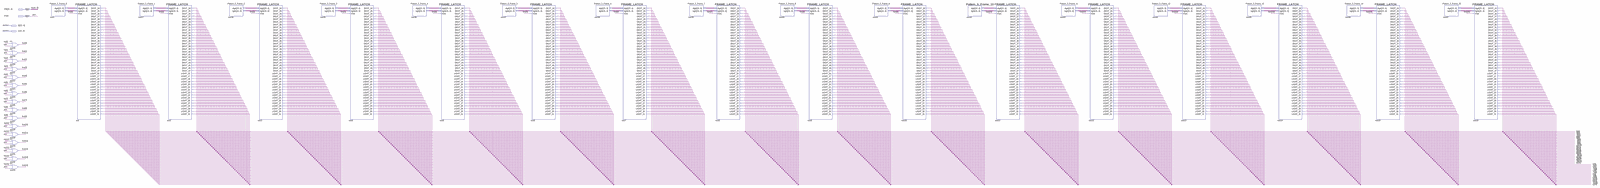
[diagram p0: schematic sheet, whole]
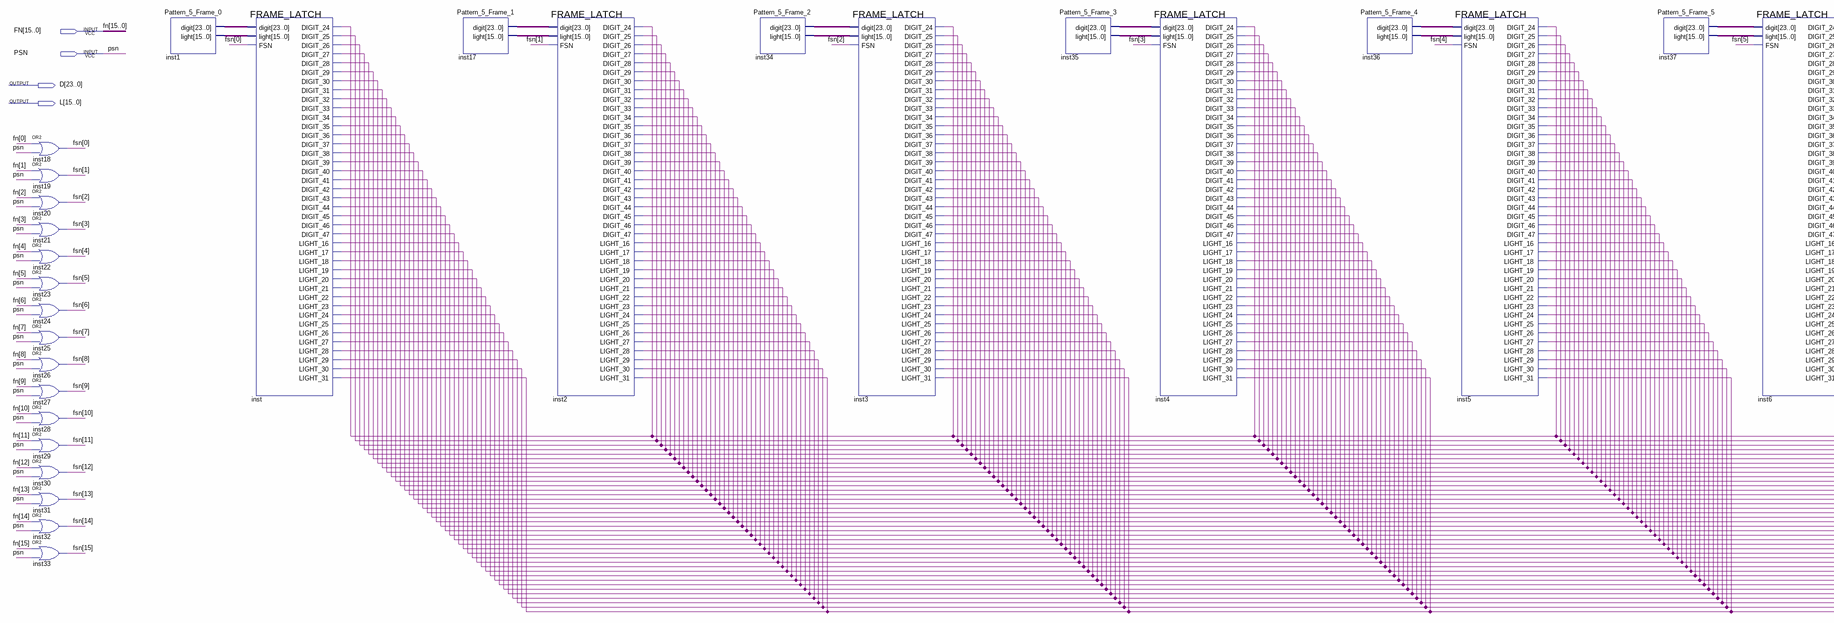
[diagram p1: schematic sheet, left part]
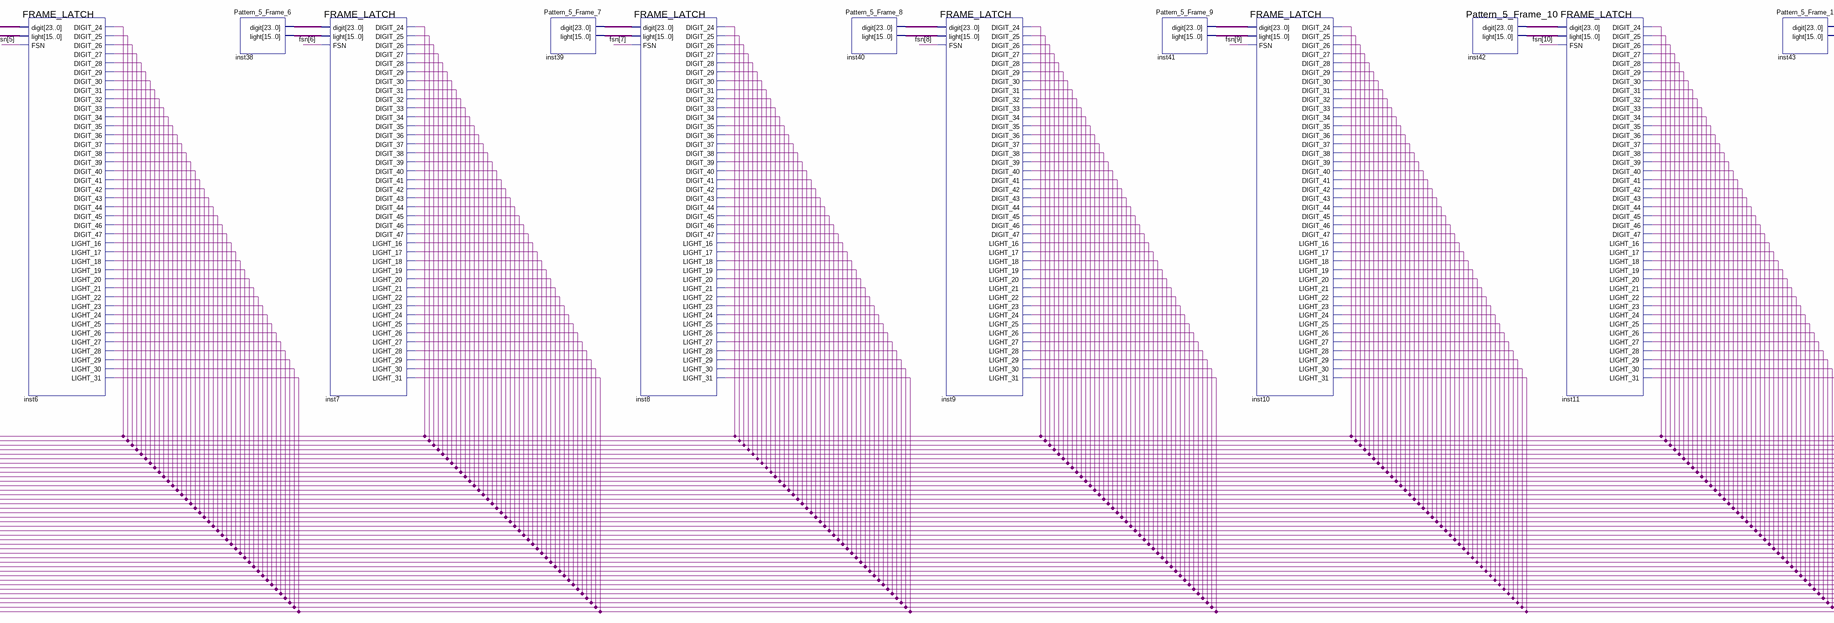
[diagram p2: schematic sheet, centre part]
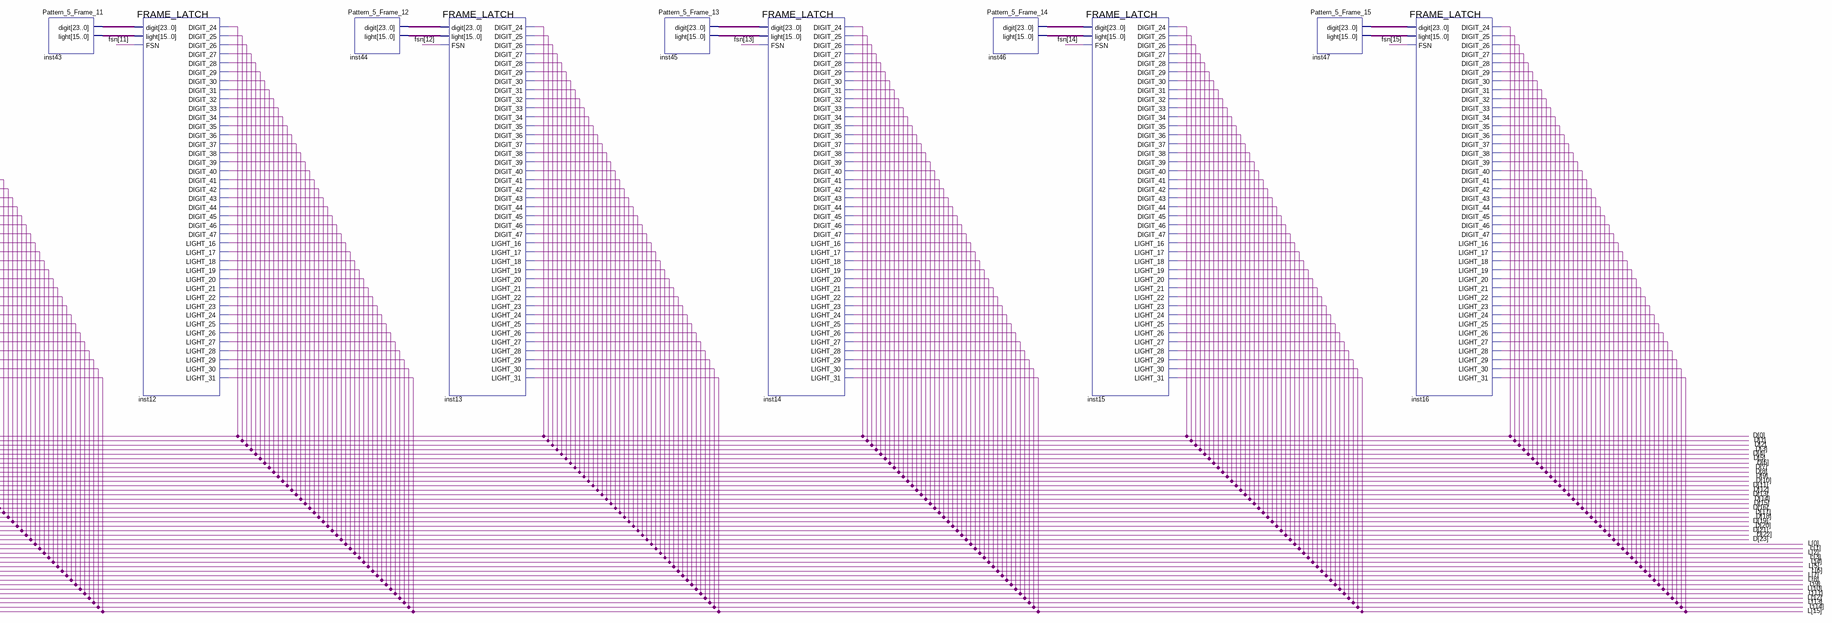
[diagram p3: schematic sheet, right part]
// Quartus schematic Pattern_5.bdf as structural Verilog: 48 symbols, 4 pins
module Pattern_5 (
  input  [15:0] FN,
  input  PSN,
  output [23:0] D,
  output [15:0] L
);

  wire [15:0] fsn, inst1_light, inst17_light, inst34_light, inst35_light, inst36_light, inst37_light,
       inst38_light, inst39_light, inst40_light, inst41_light, inst42_light, inst43_light, inst44_light,
       inst45_light, inst46_light, inst47_light;
  wire [23:0] inst1_digit, inst17_digit, inst34_digit, inst35_digit, inst36_digit, inst37_digit,
       inst38_digit, inst39_digit, inst40_digit, inst41_digit, inst42_digit, inst43_digit, inst44_digit,
       inst45_digit, inst46_digit, inst47_digit;

  or inst18 (fsn[0], FN[0], PSN);
  or inst19 (fsn[1], FN[1], PSN);
  or inst20 (fsn[2], FN[2], PSN);
  or inst21 (fsn[3], FN[3], PSN);
  or inst22 (fsn[4], FN[4], PSN);
  or inst23 (fsn[5], FN[5], PSN);
  or inst24 (fsn[6], FN[6], PSN);
  or inst25 (fsn[7], FN[7], PSN);
  or inst26 (fsn[8], FN[8], PSN);
  or inst27 (fsn[9], FN[9], PSN);
  or inst28 (fsn[10], FN[10], PSN);
  or inst29 (fsn[11], FN[11], PSN);
  or inst30 (fsn[12], FN[12], PSN);
  or inst31 (fsn[13], FN[13], PSN);
  or inst32 (fsn[14], FN[14], PSN);
  or inst33 (fsn[15], FN[15], PSN);
  Pattern_5_Frame_0 inst1 (.digit(inst1_digit), .light(inst1_light));
  FRAME_LATCH inst (
    .digit(inst1_digit), .light(inst1_light), .FSN(fsn[0]), .DIGIT_24(D[0]), .DIGIT_25(D[1]),
    .DIGIT_26(D[2]), .DIGIT_27(D[3]), .DIGIT_28(D[4]), .DIGIT_29(D[5]), .DIGIT_30(D[6]), .DIGIT_31(D[7]),
    .DIGIT_32(D[8]), .DIGIT_33(D[9]), .DIGIT_34(D[10]), .DIGIT_35(D[11]), .DIGIT_36(D[12]), .DIGIT_37(D[13]),
    .DIGIT_38(D[14]), .DIGIT_39(D[15]), .DIGIT_40(D[16]), .DIGIT_41(D[17]), .DIGIT_42(D[18]),
    .DIGIT_43(D[19]), .DIGIT_44(D[20]), .DIGIT_45(D[21]), .DIGIT_46(D[22]), .DIGIT_47(D[23]),
    .LIGHT_16(L[0]), .LIGHT_17(L[1]), .LIGHT_18(L[2]), .LIGHT_19(L[3]), .LIGHT_20(L[4]), .LIGHT_21(L[5]),
    .LIGHT_22(L[6]), .LIGHT_23(L[7]), .LIGHT_24(L[8]), .LIGHT_25(L[9]), .LIGHT_26(L[10]), .LIGHT_27(L[11]),
    .LIGHT_28(L[12]), .LIGHT_29(L[13]), .LIGHT_30(L[14]), .LIGHT_31(L[15]));
  Pattern_5_Frame_1 inst17 (.digit(inst17_digit), .light(inst17_light));
  FRAME_LATCH inst2 (
    .digit(inst17_digit), .light(inst17_light), .FSN(fsn[1]), .DIGIT_24(D[0]), .DIGIT_25(D[1]),
    .DIGIT_26(D[2]), .DIGIT_27(D[3]), .DIGIT_28(D[4]), .DIGIT_29(D[5]), .DIGIT_30(D[6]), .DIGIT_31(D[7]),
    .DIGIT_32(D[8]), .DIGIT_33(D[9]), .DIGIT_34(D[10]), .DIGIT_35(D[11]), .DIGIT_36(D[12]), .DIGIT_37(D[13]),
    .DIGIT_38(D[14]), .DIGIT_39(D[15]), .DIGIT_40(D[16]), .DIGIT_41(D[17]), .DIGIT_42(D[18]),
    .DIGIT_43(D[19]), .DIGIT_44(D[20]), .DIGIT_45(D[21]), .DIGIT_46(D[22]), .DIGIT_47(D[23]),
    .LIGHT_16(L[0]), .LIGHT_17(L[1]), .LIGHT_18(L[2]), .LIGHT_19(L[3]), .LIGHT_20(L[4]), .LIGHT_21(L[5]),
    .LIGHT_22(L[6]), .LIGHT_23(L[7]), .LIGHT_24(L[8]), .LIGHT_25(L[9]), .LIGHT_26(L[10]), .LIGHT_27(L[11]),
    .LIGHT_28(L[12]), .LIGHT_29(L[13]), .LIGHT_30(L[14]), .LIGHT_31(L[15]));
  Pattern_5_Frame_2 inst34 (.digit(inst34_digit), .light(inst34_light));
  FRAME_LATCH inst3 (
    .digit(inst34_digit), .light(inst34_light), .FSN(fsn[2]), .DIGIT_24(D[0]), .DIGIT_25(D[1]),
    .DIGIT_26(D[2]), .DIGIT_27(D[3]), .DIGIT_28(D[4]), .DIGIT_29(D[5]), .DIGIT_30(D[6]), .DIGIT_31(D[7]),
    .DIGIT_32(D[8]), .DIGIT_33(D[9]), .DIGIT_34(D[10]), .DIGIT_35(D[11]), .DIGIT_36(D[12]), .DIGIT_37(D[13]),
    .DIGIT_38(D[14]), .DIGIT_39(D[15]), .DIGIT_40(D[16]), .DIGIT_41(D[17]), .DIGIT_42(D[18]),
    .DIGIT_43(D[19]), .DIGIT_44(D[20]), .DIGIT_45(D[21]), .DIGIT_46(D[22]), .DIGIT_47(D[23]),
    .LIGHT_16(L[0]), .LIGHT_17(L[1]), .LIGHT_18(L[2]), .LIGHT_19(L[3]), .LIGHT_20(L[4]), .LIGHT_21(L[5]),
    .LIGHT_22(L[6]), .LIGHT_23(L[7]), .LIGHT_24(L[8]), .LIGHT_25(L[9]), .LIGHT_26(L[10]), .LIGHT_27(L[11]),
    .LIGHT_28(L[12]), .LIGHT_29(L[13]), .LIGHT_30(L[14]), .LIGHT_31(L[15]));
  Pattern_5_Frame_3 inst35 (.digit(inst35_digit), .light(inst35_light));
  FRAME_LATCH inst4 (
    .digit(inst35_digit), .light(inst35_light), .FSN(fsn[3]), .DIGIT_24(D[0]), .DIGIT_25(D[1]),
    .DIGIT_26(D[2]), .DIGIT_27(D[3]), .DIGIT_28(D[4]), .DIGIT_29(D[5]), .DIGIT_30(D[6]), .DIGIT_31(D[7]),
    .DIGIT_32(D[8]), .DIGIT_33(D[9]), .DIGIT_34(D[10]), .DIGIT_35(D[11]), .DIGIT_36(D[12]), .DIGIT_37(D[13]),
    .DIGIT_38(D[14]), .DIGIT_39(D[15]), .DIGIT_40(D[16]), .DIGIT_41(D[17]), .DIGIT_42(D[18]),
    .DIGIT_43(D[19]), .DIGIT_44(D[20]), .DIGIT_45(D[21]), .DIGIT_46(D[22]), .DIGIT_47(D[23]),
    .LIGHT_16(L[0]), .LIGHT_17(L[1]), .LIGHT_18(L[2]), .LIGHT_19(L[3]), .LIGHT_20(L[4]), .LIGHT_21(L[5]),
    .LIGHT_22(L[6]), .LIGHT_23(L[7]), .LIGHT_24(L[8]), .LIGHT_25(L[9]), .LIGHT_26(L[10]), .LIGHT_27(L[11]),
    .LIGHT_28(L[12]), .LIGHT_29(L[13]), .LIGHT_30(L[14]), .LIGHT_31(L[15]));
  Pattern_5_Frame_4 inst36 (.digit(inst36_digit), .light(inst36_light));
  FRAME_LATCH inst5 (
    .digit(inst36_digit), .light(inst36_light), .FSN(fsn[4]), .DIGIT_24(D[0]), .DIGIT_25(D[1]),
    .DIGIT_26(D[2]), .DIGIT_27(D[3]), .DIGIT_28(D[4]), .DIGIT_29(D[5]), .DIGIT_30(D[6]), .DIGIT_31(D[7]),
    .DIGIT_32(D[8]), .DIGIT_33(D[9]), .DIGIT_34(D[10]), .DIGIT_35(D[11]), .DIGIT_36(D[12]), .DIGIT_37(D[13]),
    .DIGIT_38(D[14]), .DIGIT_39(D[15]), .DIGIT_40(D[16]), .DIGIT_41(D[17]), .DIGIT_42(D[18]),
    .DIGIT_43(D[19]), .DIGIT_44(D[20]), .DIGIT_45(D[21]), .DIGIT_46(D[22]), .DIGIT_47(D[23]),
    .LIGHT_16(L[0]), .LIGHT_17(L[1]), .LIGHT_18(L[2]), .LIGHT_19(L[3]), .LIGHT_20(L[4]), .LIGHT_21(L[5]),
    .LIGHT_22(L[6]), .LIGHT_23(L[7]), .LIGHT_24(L[8]), .LIGHT_25(L[9]), .LIGHT_26(L[10]), .LIGHT_27(L[11]),
    .LIGHT_28(L[12]), .LIGHT_29(L[13]), .LIGHT_30(L[14]), .LIGHT_31(L[15]));
  Pattern_5_Frame_5 inst37 (.digit(inst37_digit), .light(inst37_light));
  FRAME_LATCH inst6 (
    .digit(inst37_digit), .light(inst37_light), .FSN(fsn[5]), .DIGIT_24(D[0]), .DIGIT_25(D[1]),
    .DIGIT_26(D[2]), .DIGIT_27(D[3]), .DIGIT_28(D[4]), .DIGIT_29(D[5]), .DIGIT_30(D[6]), .DIGIT_31(D[7]),
    .DIGIT_32(D[8]), .DIGIT_33(D[9]), .DIGIT_34(D[10]), .DIGIT_35(D[11]), .DIGIT_36(D[12]), .DIGIT_37(D[13]),
    .DIGIT_38(D[14]), .DIGIT_39(D[15]), .DIGIT_40(D[16]), .DIGIT_41(D[17]), .DIGIT_42(D[18]),
    .DIGIT_43(D[19]), .DIGIT_44(D[20]), .DIGIT_45(D[21]), .DIGIT_46(D[22]), .DIGIT_47(D[23]),
    .LIGHT_16(L[0]), .LIGHT_17(L[1]), .LIGHT_18(L[2]), .LIGHT_19(L[3]), .LIGHT_20(L[4]), .LIGHT_21(L[5]),
    .LIGHT_22(L[6]), .LIGHT_23(L[7]), .LIGHT_24(L[8]), .LIGHT_25(L[9]), .LIGHT_26(L[10]), .LIGHT_27(L[11]),
    .LIGHT_28(L[12]), .LIGHT_29(L[13]), .LIGHT_30(L[14]), .LIGHT_31(L[15]));
  Pattern_5_Frame_6 inst38 (.digit(inst38_digit), .light(inst38_light));
  FRAME_LATCH inst7 (
    .digit(inst38_digit), .light(inst38_light), .FSN(fsn[6]), .DIGIT_24(D[0]), .DIGIT_25(D[1]),
    .DIGIT_26(D[2]), .DIGIT_27(D[3]), .DIGIT_28(D[4]), .DIGIT_29(D[5]), .DIGIT_30(D[6]), .DIGIT_31(D[7]),
    .DIGIT_32(D[8]), .DIGIT_33(D[9]), .DIGIT_34(D[10]), .DIGIT_35(D[11]), .DIGIT_36(D[12]), .DIGIT_37(D[13]),
    .DIGIT_38(D[14]), .DIGIT_39(D[15]), .DIGIT_40(D[16]), .DIGIT_41(D[17]), .DIGIT_42(D[18]),
    .DIGIT_43(D[19]), .DIGIT_44(D[20]), .DIGIT_45(D[21]), .DIGIT_46(D[22]), .DIGIT_47(D[23]),
    .LIGHT_16(L[0]), .LIGHT_17(L[1]), .LIGHT_18(L[2]), .LIGHT_19(L[3]), .LIGHT_20(L[4]), .LIGHT_21(L[5]),
    .LIGHT_22(L[6]), .LIGHT_23(L[7]), .LIGHT_24(L[8]), .LIGHT_25(L[9]), .LIGHT_26(L[10]), .LIGHT_27(L[11]),
    .LIGHT_28(L[12]), .LIGHT_29(L[13]), .LIGHT_30(L[14]), .LIGHT_31(L[15]));
  Pattern_5_Frame_7 inst39 (.digit(inst39_digit), .light(inst39_light));
  FRAME_LATCH inst8 (
    .digit(inst39_digit), .light(inst39_light), .FSN(fsn[7]), .DIGIT_24(D[0]), .DIGIT_25(D[1]),
    .DIGIT_26(D[2]), .DIGIT_27(D[3]), .DIGIT_28(D[4]), .DIGIT_29(D[5]), .DIGIT_30(D[6]), .DIGIT_31(D[7]),
    .DIGIT_32(D[8]), .DIGIT_33(D[9]), .DIGIT_34(D[10]), .DIGIT_35(D[11]), .DIGIT_36(D[12]), .DIGIT_37(D[13]),
    .DIGIT_38(D[14]), .DIGIT_39(D[15]), .DIGIT_40(D[16]), .DIGIT_41(D[17]), .DIGIT_42(D[18]),
    .DIGIT_43(D[19]), .DIGIT_44(D[20]), .DIGIT_45(D[21]), .DIGIT_46(D[22]), .DIGIT_47(D[23]),
    .LIGHT_16(L[0]), .LIGHT_17(L[1]), .LIGHT_18(L[2]), .LIGHT_19(L[3]), .LIGHT_20(L[4]), .LIGHT_21(L[5]),
    .LIGHT_22(L[6]), .LIGHT_23(L[7]), .LIGHT_24(L[8]), .LIGHT_25(L[9]), .LIGHT_26(L[10]), .LIGHT_27(L[11]),
    .LIGHT_28(L[12]), .LIGHT_29(L[13]), .LIGHT_30(L[14]), .LIGHT_31(L[15]));
  Pattern_5_Frame_8 inst40 (.digit(inst40_digit), .light(inst40_light));
  FRAME_LATCH inst9 (
    .digit(inst40_digit), .light(inst40_light), .FSN(fsn[8]), .DIGIT_24(D[0]), .DIGIT_25(D[1]),
    .DIGIT_26(D[2]), .DIGIT_27(D[3]), .DIGIT_28(D[4]), .DIGIT_29(D[5]), .DIGIT_30(D[6]), .DIGIT_31(D[7]),
    .DIGIT_32(D[8]), .DIGIT_33(D[9]), .DIGIT_34(D[10]), .DIGIT_35(D[11]), .DIGIT_36(D[12]), .DIGIT_37(D[13]),
    .DIGIT_38(D[14]), .DIGIT_39(D[15]), .DIGIT_40(D[16]), .DIGIT_41(D[17]), .DIGIT_42(D[18]),
    .DIGIT_43(D[19]), .DIGIT_44(D[20]), .DIGIT_45(D[21]), .DIGIT_46(D[22]), .DIGIT_47(D[23]),
    .LIGHT_16(L[0]), .LIGHT_17(L[1]), .LIGHT_18(L[2]), .LIGHT_19(L[3]), .LIGHT_20(L[4]), .LIGHT_21(L[5]),
    .LIGHT_22(L[6]), .LIGHT_23(L[7]), .LIGHT_24(L[8]), .LIGHT_25(L[9]), .LIGHT_26(L[10]), .LIGHT_27(L[11]),
    .LIGHT_28(L[12]), .LIGHT_29(L[13]), .LIGHT_30(L[14]), .LIGHT_31(L[15]));
  Pattern_5_Frame_9 inst41 (.digit(inst41_digit), .light(inst41_light));
  FRAME_LATCH inst10 (
    .digit(inst41_digit), .light(inst41_light), .FSN(fsn[9]), .DIGIT_24(D[0]), .DIGIT_25(D[1]),
    .DIGIT_26(D[2]), .DIGIT_27(D[3]), .DIGIT_28(D[4]), .DIGIT_29(D[5]), .DIGIT_30(D[6]), .DIGIT_31(D[7]),
    .DIGIT_32(D[8]), .DIGIT_33(D[9]), .DIGIT_34(D[10]), .DIGIT_35(D[11]), .DIGIT_36(D[12]), .DIGIT_37(D[13]),
    .DIGIT_38(D[14]), .DIGIT_39(D[15]), .DIGIT_40(D[16]), .DIGIT_41(D[17]), .DIGIT_42(D[18]),
    .DIGIT_43(D[19]), .DIGIT_44(D[20]), .DIGIT_45(D[21]), .DIGIT_46(D[22]), .DIGIT_47(D[23]),
    .LIGHT_16(L[0]), .LIGHT_17(L[1]), .LIGHT_18(L[2]), .LIGHT_19(L[3]), .LIGHT_20(L[4]), .LIGHT_21(L[5]),
    .LIGHT_22(L[6]), .LIGHT_23(L[7]), .LIGHT_24(L[8]), .LIGHT_25(L[9]), .LIGHT_26(L[10]), .LIGHT_27(L[11]),
    .LIGHT_28(L[12]), .LIGHT_29(L[13]), .LIGHT_30(L[14]), .LIGHT_31(L[15]));
  Pattern_5_Frame_10 inst42 (.digit(inst42_digit), .light(inst42_light));
  FRAME_LATCH inst11 (
    .digit(inst42_digit), .light(inst42_light), .FSN(fsn[10]), .DIGIT_24(D[0]), .DIGIT_25(D[1]),
    .DIGIT_26(D[2]), .DIGIT_27(D[3]), .DIGIT_28(D[4]), .DIGIT_29(D[5]), .DIGIT_30(D[6]), .DIGIT_31(D[7]),
    .DIGIT_32(D[8]), .DIGIT_33(D[9]), .DIGIT_34(D[10]), .DIGIT_35(D[11]), .DIGIT_36(D[12]), .DIGIT_37(D[13]),
    .DIGIT_38(D[14]), .DIGIT_39(D[15]), .DIGIT_40(D[16]), .DIGIT_41(D[17]), .DIGIT_42(D[18]),
    .DIGIT_43(D[19]), .DIGIT_44(D[20]), .DIGIT_45(D[21]), .DIGIT_46(D[22]), .DIGIT_47(D[23]),
    .LIGHT_16(L[0]), .LIGHT_17(L[1]), .LIGHT_18(L[2]), .LIGHT_19(L[3]), .LIGHT_20(L[4]), .LIGHT_21(L[5]),
    .LIGHT_22(L[6]), .LIGHT_23(L[7]), .LIGHT_24(L[8]), .LIGHT_25(L[9]), .LIGHT_26(L[10]), .LIGHT_27(L[11]),
    .LIGHT_28(L[12]), .LIGHT_29(L[13]), .LIGHT_30(L[14]), .LIGHT_31(L[15]));
  Pattern_5_Frame_11 inst43 (.digit(inst43_digit), .light(inst43_light));
  FRAME_LATCH inst12 (
    .digit(inst43_digit), .light(inst43_light), .FSN(fsn[11]), .DIGIT_24(D[0]), .DIGIT_25(D[1]),
    .DIGIT_26(D[2]), .DIGIT_27(D[3]), .DIGIT_28(D[4]), .DIGIT_29(D[5]), .DIGIT_30(D[6]), .DIGIT_31(D[7]),
    .DIGIT_32(D[8]), .DIGIT_33(D[9]), .DIGIT_34(D[10]), .DIGIT_35(D[11]), .DIGIT_36(D[12]), .DIGIT_37(D[13]),
    .DIGIT_38(D[14]), .DIGIT_39(D[15]), .DIGIT_40(D[16]), .DIGIT_41(D[17]), .DIGIT_42(D[18]),
    .DIGIT_43(D[19]), .DIGIT_44(D[20]), .DIGIT_45(D[21]), .DIGIT_46(D[22]), .DIGIT_47(D[23]),
    .LIGHT_16(L[0]), .LIGHT_17(L[1]), .LIGHT_18(L[2]), .LIGHT_19(L[3]), .LIGHT_20(L[4]), .LIGHT_21(L[5]),
    .LIGHT_22(L[6]), .LIGHT_23(L[7]), .LIGHT_24(L[8]), .LIGHT_25(L[9]), .LIGHT_26(L[10]), .LIGHT_27(L[11]),
    .LIGHT_28(L[12]), .LIGHT_29(L[13]), .LIGHT_30(L[14]), .LIGHT_31(L[15]));
  Pattern_5_Frame_12 inst44 (.digit(inst44_digit), .light(inst44_light));
  FRAME_LATCH inst13 (
    .digit(inst44_digit), .light(inst44_light), .FSN(fsn[12]), .DIGIT_24(D[0]), .DIGIT_25(D[1]),
    .DIGIT_26(D[2]), .DIGIT_27(D[3]), .DIGIT_28(D[4]), .DIGIT_29(D[5]), .DIGIT_30(D[6]), .DIGIT_31(D[7]),
    .DIGIT_32(D[8]), .DIGIT_33(D[9]), .DIGIT_34(D[10]), .DIGIT_35(D[11]), .DIGIT_36(D[12]), .DIGIT_37(D[13]),
    .DIGIT_38(D[14]), .DIGIT_39(D[15]), .DIGIT_40(D[16]), .DIGIT_41(D[17]), .DIGIT_42(D[18]),
    .DIGIT_43(D[19]), .DIGIT_44(D[20]), .DIGIT_45(D[21]), .DIGIT_46(D[22]), .DIGIT_47(D[23]),
    .LIGHT_16(L[0]), .LIGHT_17(L[1]), .LIGHT_18(L[2]), .LIGHT_19(L[3]), .LIGHT_20(L[4]), .LIGHT_21(L[5]),
    .LIGHT_22(L[6]), .LIGHT_23(L[7]), .LIGHT_24(L[8]), .LIGHT_25(L[9]), .LIGHT_26(L[10]), .LIGHT_27(L[11]),
    .LIGHT_28(L[12]), .LIGHT_29(L[13]), .LIGHT_30(L[14]), .LIGHT_31(L[15]));
  Pattern_5_Frame_13 inst45 (.digit(inst45_digit), .light(inst45_light));
  FRAME_LATCH inst14 (
    .digit(inst45_digit), .light(inst45_light), .FSN(fsn[13]), .DIGIT_24(D[0]), .DIGIT_25(D[1]),
    .DIGIT_26(D[2]), .DIGIT_27(D[3]), .DIGIT_28(D[4]), .DIGIT_29(D[5]), .DIGIT_30(D[6]), .DIGIT_31(D[7]),
    .DIGIT_32(D[8]), .DIGIT_33(D[9]), .DIGIT_34(D[10]), .DIGIT_35(D[11]), .DIGIT_36(D[12]), .DIGIT_37(D[13]),
    .DIGIT_38(D[14]), .DIGIT_39(D[15]), .DIGIT_40(D[16]), .DIGIT_41(D[17]), .DIGIT_42(D[18]),
    .DIGIT_43(D[19]), .DIGIT_44(D[20]), .DIGIT_45(D[21]), .DIGIT_46(D[22]), .DIGIT_47(D[23]),
    .LIGHT_16(L[0]), .LIGHT_17(L[1]), .LIGHT_18(L[2]), .LIGHT_19(L[3]), .LIGHT_20(L[4]), .LIGHT_21(L[5]),
    .LIGHT_22(L[6]), .LIGHT_23(L[7]), .LIGHT_24(L[8]), .LIGHT_25(L[9]), .LIGHT_26(L[10]), .LIGHT_27(L[11]),
    .LIGHT_28(L[12]), .LIGHT_29(L[13]), .LIGHT_30(L[14]), .LIGHT_31(L[15]));
  Pattern_5_Frame_14 inst46 (.digit(inst46_digit), .light(inst46_light));
  FRAME_LATCH inst15 (
    .digit(inst46_digit), .light(inst46_light), .FSN(fsn[14]), .DIGIT_24(D[0]), .DIGIT_25(D[1]),
    .DIGIT_26(D[2]), .DIGIT_27(D[3]), .DIGIT_28(D[4]), .DIGIT_29(D[5]), .DIGIT_30(D[6]), .DIGIT_31(D[7]),
    .DIGIT_32(D[8]), .DIGIT_33(D[9]), .DIGIT_34(D[10]), .DIGIT_35(D[11]), .DIGIT_36(D[12]), .DIGIT_37(D[13]),
    .DIGIT_38(D[14]), .DIGIT_39(D[15]), .DIGIT_40(D[16]), .DIGIT_41(D[17]), .DIGIT_42(D[18]),
    .DIGIT_43(D[19]), .DIGIT_44(D[20]), .DIGIT_45(D[21]), .DIGIT_46(D[22]), .DIGIT_47(D[23]),
    .LIGHT_16(L[0]), .LIGHT_17(L[1]), .LIGHT_18(L[2]), .LIGHT_19(L[3]), .LIGHT_20(L[4]), .LIGHT_21(L[5]),
    .LIGHT_22(L[6]), .LIGHT_23(L[7]), .LIGHT_24(L[8]), .LIGHT_25(L[9]), .LIGHT_26(L[10]), .LIGHT_27(L[11]),
    .LIGHT_28(L[12]), .LIGHT_29(L[13]), .LIGHT_30(L[14]), .LIGHT_31(L[15]));
  Pattern_5_Frame_15 inst47 (.digit(inst47_digit), .light(inst47_light));
  FRAME_LATCH inst16 (
    .digit(inst47_digit), .light(inst47_light), .FSN(fsn[15]), .DIGIT_24(D[0]), .DIGIT_25(D[1]),
    .DIGIT_26(D[2]), .DIGIT_27(D[3]), .DIGIT_28(D[4]), .DIGIT_29(D[5]), .DIGIT_30(D[6]), .DIGIT_31(D[7]),
    .DIGIT_32(D[8]), .DIGIT_33(D[9]), .DIGIT_34(D[10]), .DIGIT_35(D[11]), .DIGIT_36(D[12]), .DIGIT_37(D[13]),
    .DIGIT_38(D[14]), .DIGIT_39(D[15]), .DIGIT_40(D[16]), .DIGIT_41(D[17]), .DIGIT_42(D[18]),
    .DIGIT_43(D[19]), .DIGIT_44(D[20]), .DIGIT_45(D[21]), .DIGIT_46(D[22]), .DIGIT_47(D[23]),
    .LIGHT_16(L[0]), .LIGHT_17(L[1]), .LIGHT_18(L[2]), .LIGHT_19(L[3]), .LIGHT_20(L[4]), .LIGHT_21(L[5]),
    .LIGHT_22(L[6]), .LIGHT_23(L[7]), .LIGHT_24(L[8]), .LIGHT_25(L[9]), .LIGHT_26(L[10]), .LIGHT_27(L[11]),
    .LIGHT_28(L[12]), .LIGHT_29(L[13]), .LIGHT_30(L[14]), .LIGHT_31(L[15]));
endmodule
